# EAGLE design bm1397 (EAGLE 9.6.2)

## Sheet 1 of 3
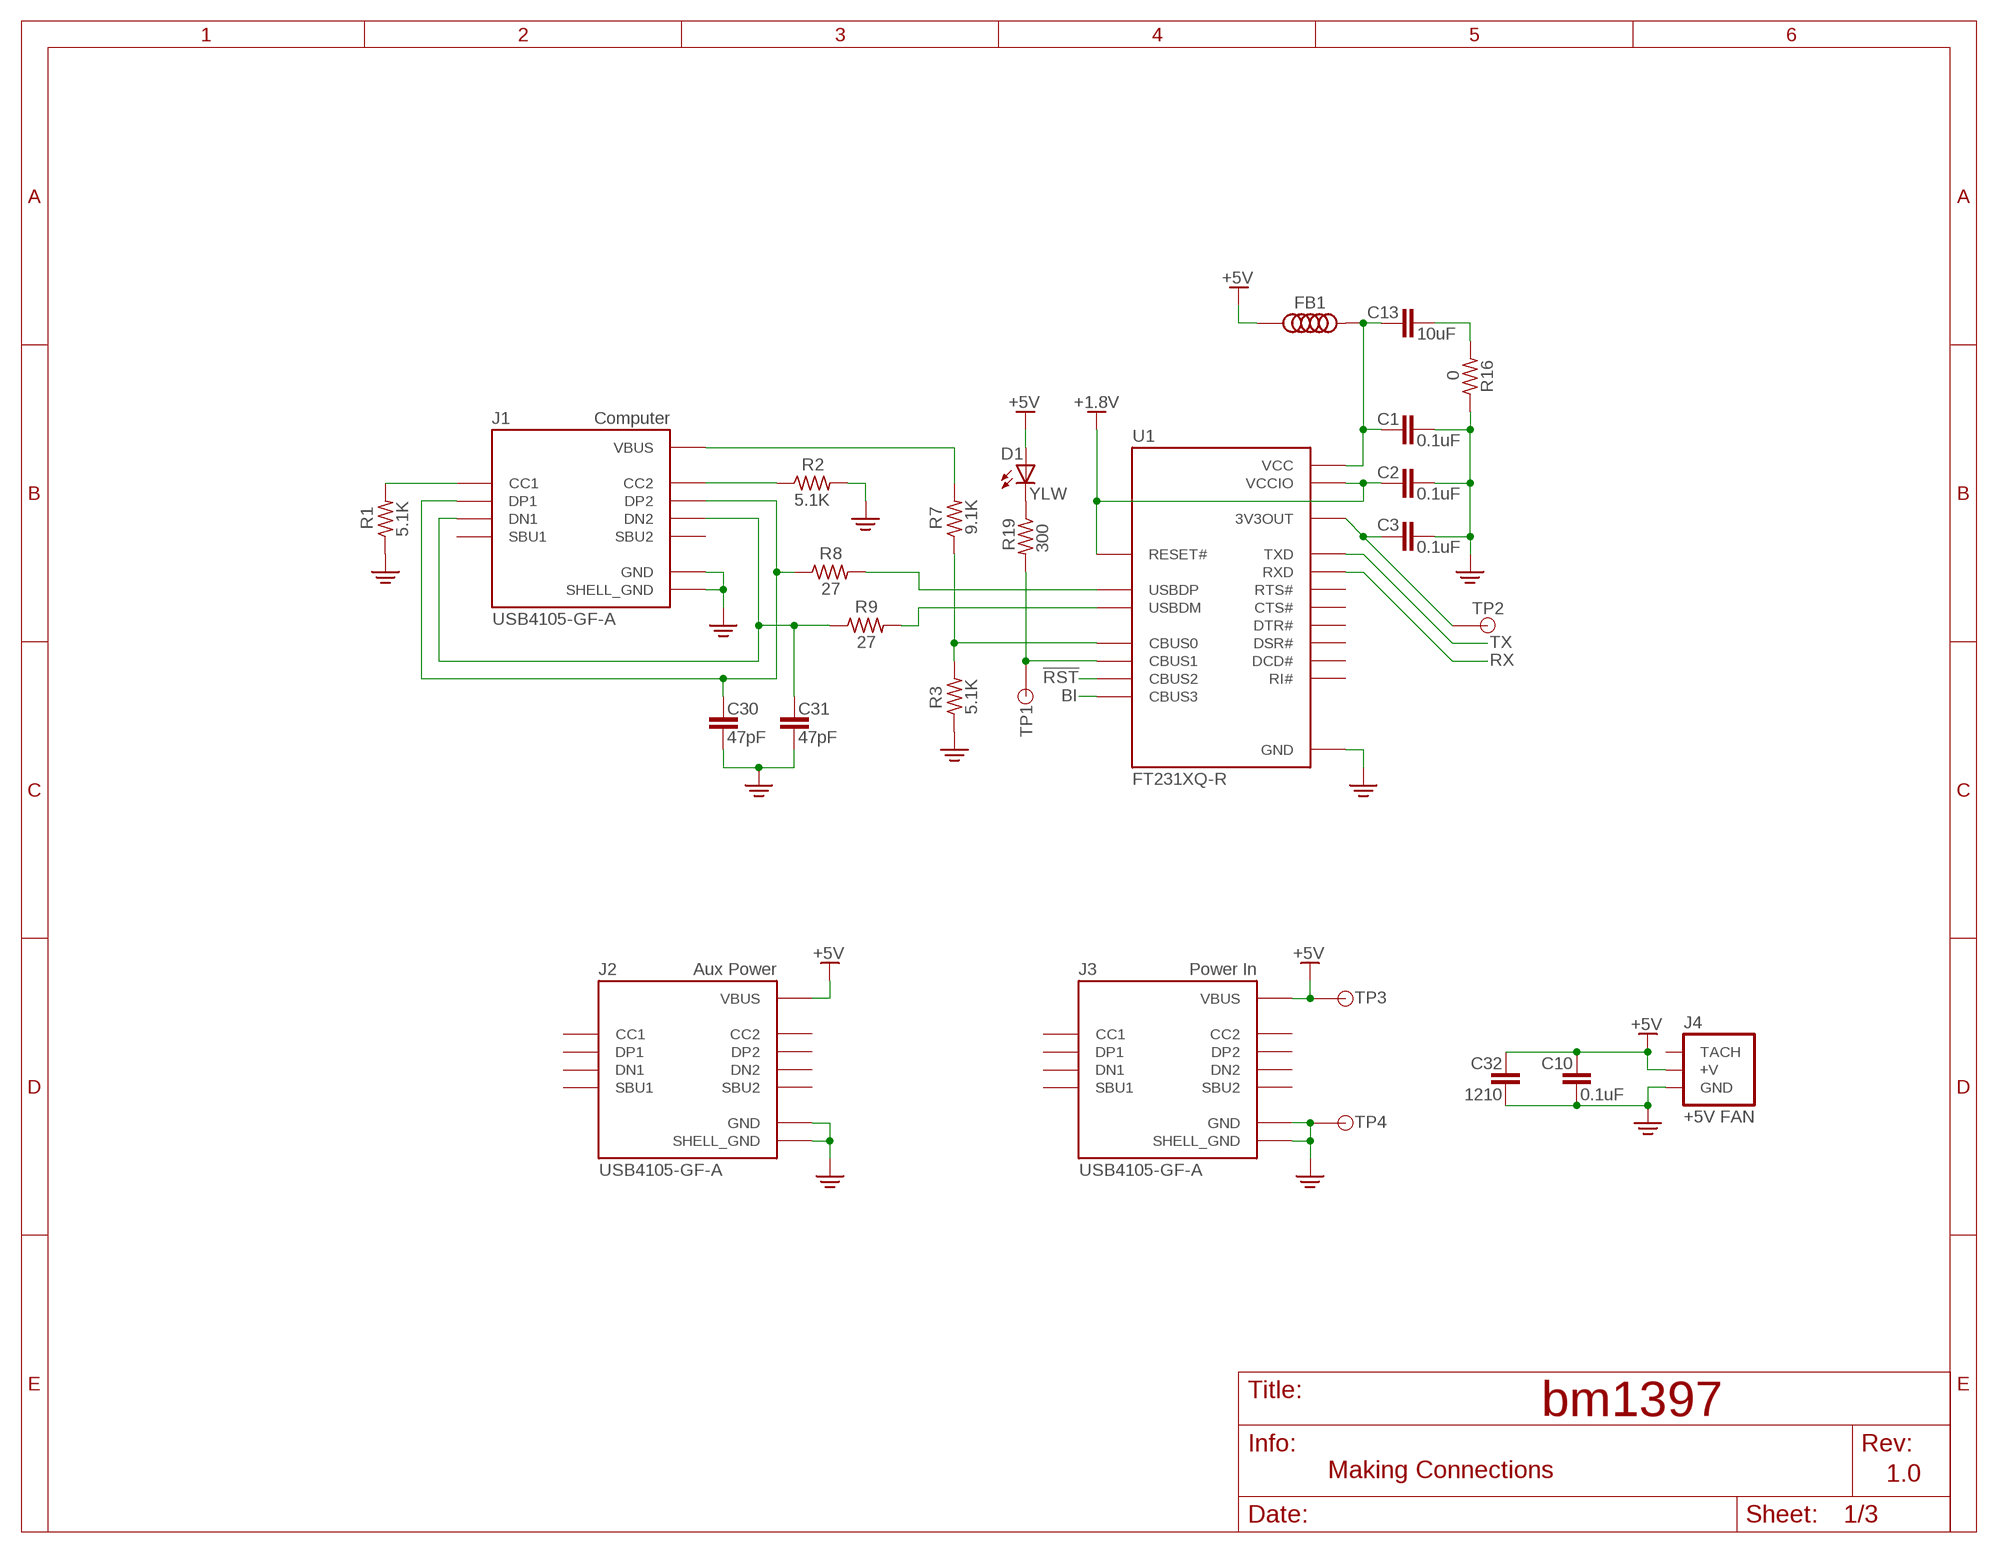
[diagram p0: schematic, sheet 1]

### Parts
C1  0.1uF  NPOL_CAPACITORC0402  [C0402]
C2  0.1uF  NPOL_CAPACITORC0402  [C0402]
C3  0.1uF  NPOL_CAPACITORC0402  [C0402]
C10  0.1uF  NPOL_CAPACITORC0402  [C0402]
C13  10uF  NPOL_CAPACITORC0805  [C0805]
C30  47pF  NPOL_CAPACITORC0402  [C0402]
C31  47pF  NPOL_CAPACITORC0402  [C0402]
C32  1210  NPOL_CAPACITORC1210  [C1210]
D1  YLW  LED  [0805_SD_MNT]
FB1  FERRITE_BEADF0402  [F0402]
J1  USB4105-GF-A  [GCT_USB4105-GF-A]
J2  USB4105-GF-A  [GCT_USB4105-GF-A]
J3  USB4105-GF-A  [GCT_USB4105-GF-A]
J4  +5V FAN  3PIN_FAN3PIN_FAN  [3PIN_LOCK_HEADER]
R1  5.1K  RESISTORR0402  [R0402]
R2  5.1K  RESISTORR0402  [R0402]
R3  5.1K  RESISTORR0402  [R0402]
R7  9.1K  RESISTORR0402  [R0402]
R8  27  RESISTORR0402  [R0402]
R9  27  RESISTORR0402  [R0402]
R16  0  RESISTORR0402  [R0402]
R19  300  RESISTORR0402  [R0402]
TP1  TESTPOINT  [0.035]
TP2  TESTPOINT  [0.035]
TP3  TESTPOINT  [0.035]
TP4  TESTPOINT  [0.035]
U1  FT231XQ-R  [QFN50P400X400X80-21N]

### Nets
!RST: U1.7(CBUS2) ; also sheet 3
+1V8: C2.1 U1.11(RESET#) U1.20(VCCIO) ; supply symbol labelled +1.8V ; also sheet 2,3
+5V: C10.2 C32.1 D1.A FB1.1 J2.A4_B9(VBUS) J2.B4_A9(VBUS) J3.A4_B9(VBUS) J3.B4_A9(VBUS) J4.2(+V) TP3.TP ; also sheet 2
BI: U1.16(CBUS3) ; also sheet 3
CC1: J1.A5(CC1) R1.2
CC2: J1.B5(CC2) R2.1
FB+5V: C1.1 C13.1 FB1.2 U1.12(VCC)
GND: C1.2 C2.2 C3.2 C10.1 C30.1 C31.1 C32.2 J1.A1_B12(GND) J1.B1_A12(GND) J1.S1(SHELL_GND) J1.S2(SHELL_GND) J1.S3(SHELL_GND) J1.S4(SHELL_GND) J2.A1_B12(GND) J2.B1_A12(GND) J2.S1(SHELL_GND) J2.S2(SHELL_GND) J2.S3(SHELL_GND) J2.S4(SHELL_GND) J3.A1_B12(GND) J3.B1_A12(GND) J3.S1(SHELL_GND) J3.S2(SHELL_GND) J3.S3(SHELL_GND) J3.S4(SHELL_GND) J4.1(GND) R1.1 R2.2 R3.1 R16.1 TP4.TP U1.3(GND) U1.13(GND) U1.21(GND) ; also sheet 2,3
N$1: C13.2 R16.2
N$2: R8.2 U1.8(USBDP)
N$3: C30.2 J1.A6(DP1) J1.B6(DP2) R8.1
N$4: C31.2 J1.A7(DN1) J1.B7(DN2) R9.1
N$5: D1.C R19.1
N$6: R9.2 U1.9(USBDM)
N$8: R3.2 R7.1 U1.15(CBUS0)
N$9: J1.A4_B9(VBUS) J1.B4_A9(VBUS) R7.2
N$11: C3.1 TP2.TP U1.10(3V3OUT)
N$12: R19.2 TP1.TP U1.14(CBUS1)
RX: U1.1(RXD) ; also sheet 3
TX: U1.17(TXD) ; also sheet 3
Unconnected: J1.A8(SBU1) J1.B8(SBU2) J2.A5(CC1) J2.A6(DP1) J2.A7(DN1) J2.A8(SBU1) J2.B5(CC2) J2.B6(DP2) J2.B7(DN2) J2.B8(SBU2) J3.A5(CC1) J3.A6(DP1) J3.A7(DN1) J3.A8(SBU1) J3.B5(CC2) J3.B6(DP2) J3.B7(DN2) J3.B8(SBU2) J4.3(TACH) U1.2(RI#) U1.4(DSR#) U1.5(DCD#) U1.6(CTS#) U1.18(DTR#) U1.19(RTS#)

### Notes on the sheet
- Computer
- Aux Power | Power In
- Making Connections | 1.0

## Sheet 2 of 3
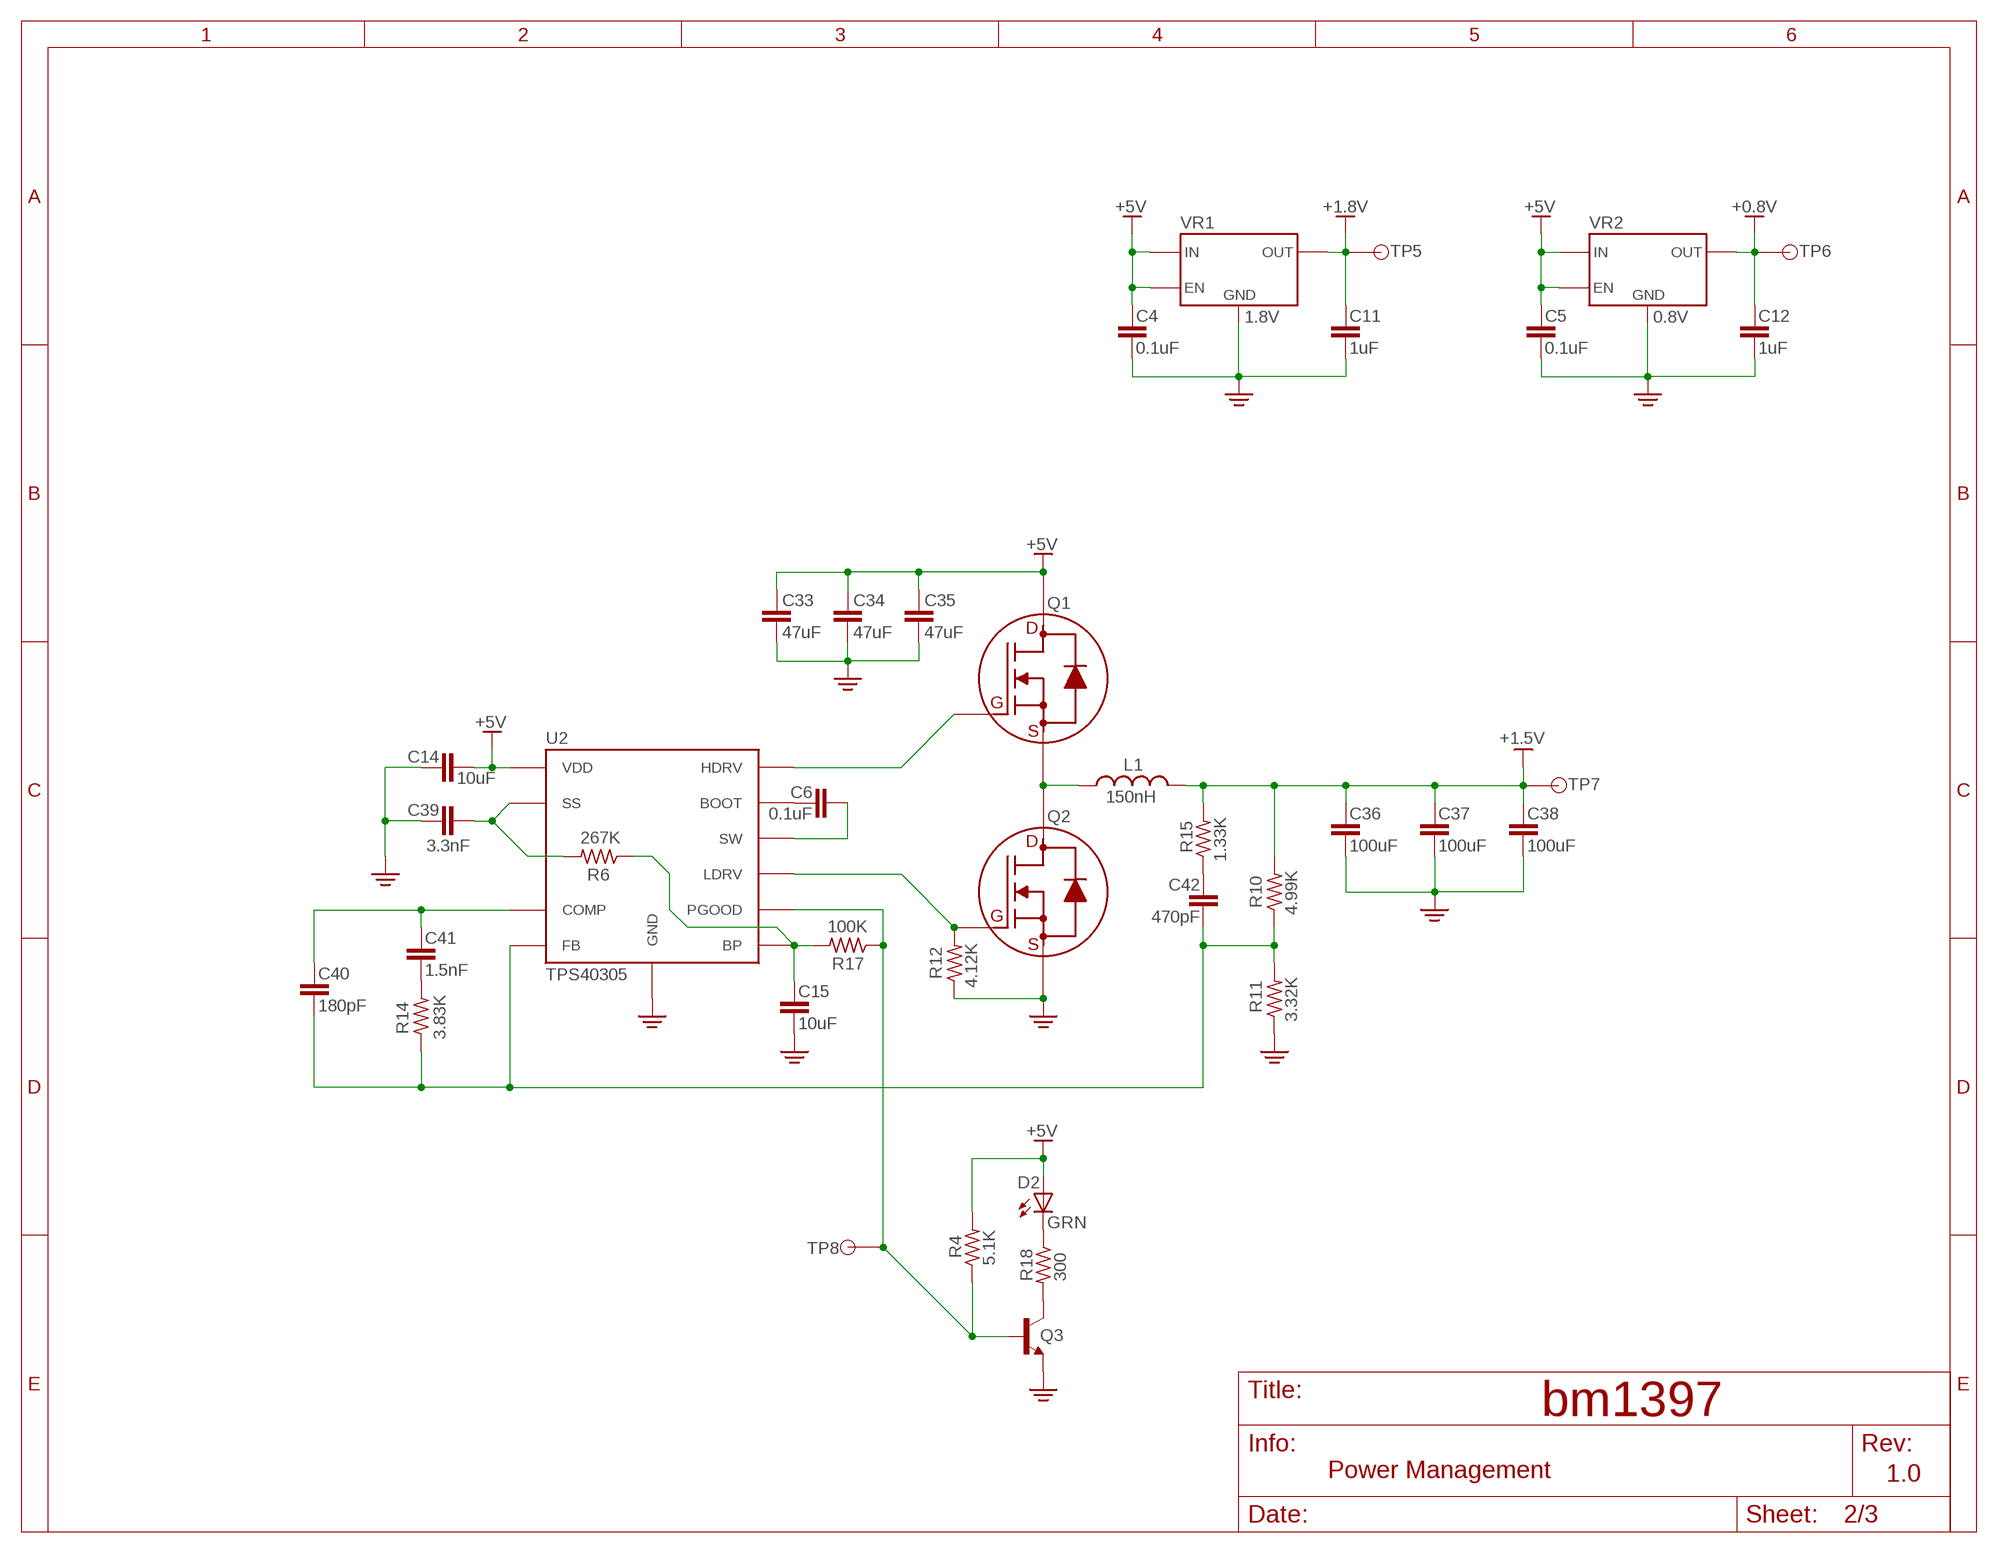
[diagram p1: schematic, sheet 2]

### Parts
C4  0.1uF  NPOL_CAPACITORC0402  [C0402]
C5  0.1uF  NPOL_CAPACITORC0402  [C0402]
C6  0.1uF  NPOL_CAPACITORC0402  [C0402]
C11  1uF  NPOL_CAPACITORC0603  [C0603]
C12  1uF  NPOL_CAPACITORC0603  [C0603]
C14  10uF  NPOL_CAPACITORC0805  [C0805]
C15  10uF  NPOL_CAPACITORC0805  [C0805]
C33  47uF  NPOL_CAPACITORC1210  [C1210]
C34  47uF  NPOL_CAPACITORC1210  [C1210]
C35  47uF  NPOL_CAPACITORC1210  [C1210]
C36  100uF  NPOL_CAPACITORC1210  [C1210]
C37  100uF  NPOL_CAPACITORC1210  [C1210]
C38  100uF  NPOL_CAPACITORC1210  [C1210]
C39  3.3nF  NPOL_CAPACITORC0402  [C0402]
C40  180pF  NPOL_CAPACITORC0402  [C0402]
C41  1.5nF  NPOL_CAPACITORC0402  [C0402]
C42  470pF  NPOL_CAPACITORC0402  [C0402]
D2  GRN  LED  [0805_SD_MNT]
L1  150nH  SMD_INDUCTOR10.2MMX7.0MM  [10.2MMX7.0MM]
Q1  8-PowerTDFN  CSD17311Q5  [CSD17311Q5]
Q2  8-PowerTDFN  CSD17311Q5  [CSD17311Q5]
Q3  NPN  [SOT23]
R4  5.1K  RESISTORR0402  [R0402]
R6  267K  RESISTORR0402  [R0402]
R10  4.99K  RESISTORR0402  [R0402]
R11  3.32K  RESISTORR0402  [R0402]
R12  4.12K  RESISTORR0402  [R0402]
R14  3.83K  RESISTORR0402  [R0402]
R15  1.33K  RESISTORR0402  [R0402]
R17  100K  RESISTORR0402  [R0402]
R18  300  RESISTORR0402  [R0402]
TP5  TESTPOINT  [0.035]
TP6  TESTPOINT  [0.035]
TP7  TESTPOINT  [0.035]
TP8  TESTPOINT  [0.035]
U2  TPS40305  [TPS40305]
VR1  1.8V  REGULATOR-ENTSOP-5  [TSOP-5]
VR2  0.8V  REGULATOR-ENTSOP-5  [TSOP-5]

### Nets
+0V8: C12.1 TP6.TP VR2.5(OUT) ; supply symbol labelled +0.8V ; also sheet 3
+1V5: C36.1 C37.1 C38.1 L1.2 R10.2 R15.2 TP7.TP ; supply symbol labelled +1.5V ; also sheet 3
+1V8: C11.1 TP5.TP VR1.5(OUT) ; supply symbol labelled +1.8V ; also sheet 1,3
+5V: C4.1 C5.1 C14.1 C33.1 C34.1 C35.1 D2.A Q1.5(D) Q1.6(D) Q1.7(D) Q1.8(D) Q1.9(D) R4.2 U2.1(VDD) VR1.1(IN) VR1.3(EN) VR2.1(IN) VR2.3(EN) ; also sheet 1
BP: C15.1 R6.1 R17.2 U2.10(BP)
GND: C4.2 C5.2 C11.2 C12.2 C14.2 C15.2 C33.2 C34.2 C35.2 C36.2 C37.2 C38.2 C39.2 Q2.1(S) Q2.2(S) Q2.3(S) Q3.2(E) R11.1 R12.1 U2.11(GND) U2.12(GND) U2.13(GND) U2.14(GND) U2.15(GND) VR1.2(GND) VR2.2(GND) ; also sheet 1,3
HDRV: Q1.4(G) U2.7(HDRV)
LDRV: Q2.4(G) R12.2 U2.9(LDRV)
LIN: L1.1 Q1.1(S) Q1.2(S) Q1.3(S) Q2.5(D) Q2.6(D) Q2.7(D) Q2.8(D) Q2.9(D)
N$10: C40.1 C41.1 U2.4(COMP)
N$13: C41.2 R14.2
N$16: C6.2 U2.6(BOOT)
N$37: C6.1 U2.8(SW)
N$55: C42.1 R15.1
N$56: C40.2 C42.2 R10.1 R11.2 R14.1 U2.5(FB)
N$58: D2.C R18.1
N$60: Q3.3(C) R18.2
PGOOD: Q3.1(B) R4.1 R17.1 TP8.TP U2.3(PGOOD)
SS: C39.1 R6.2 U2.2(SS)

### Notes on the sheet
- Power Management | 1.0

## Sheet 3 of 3
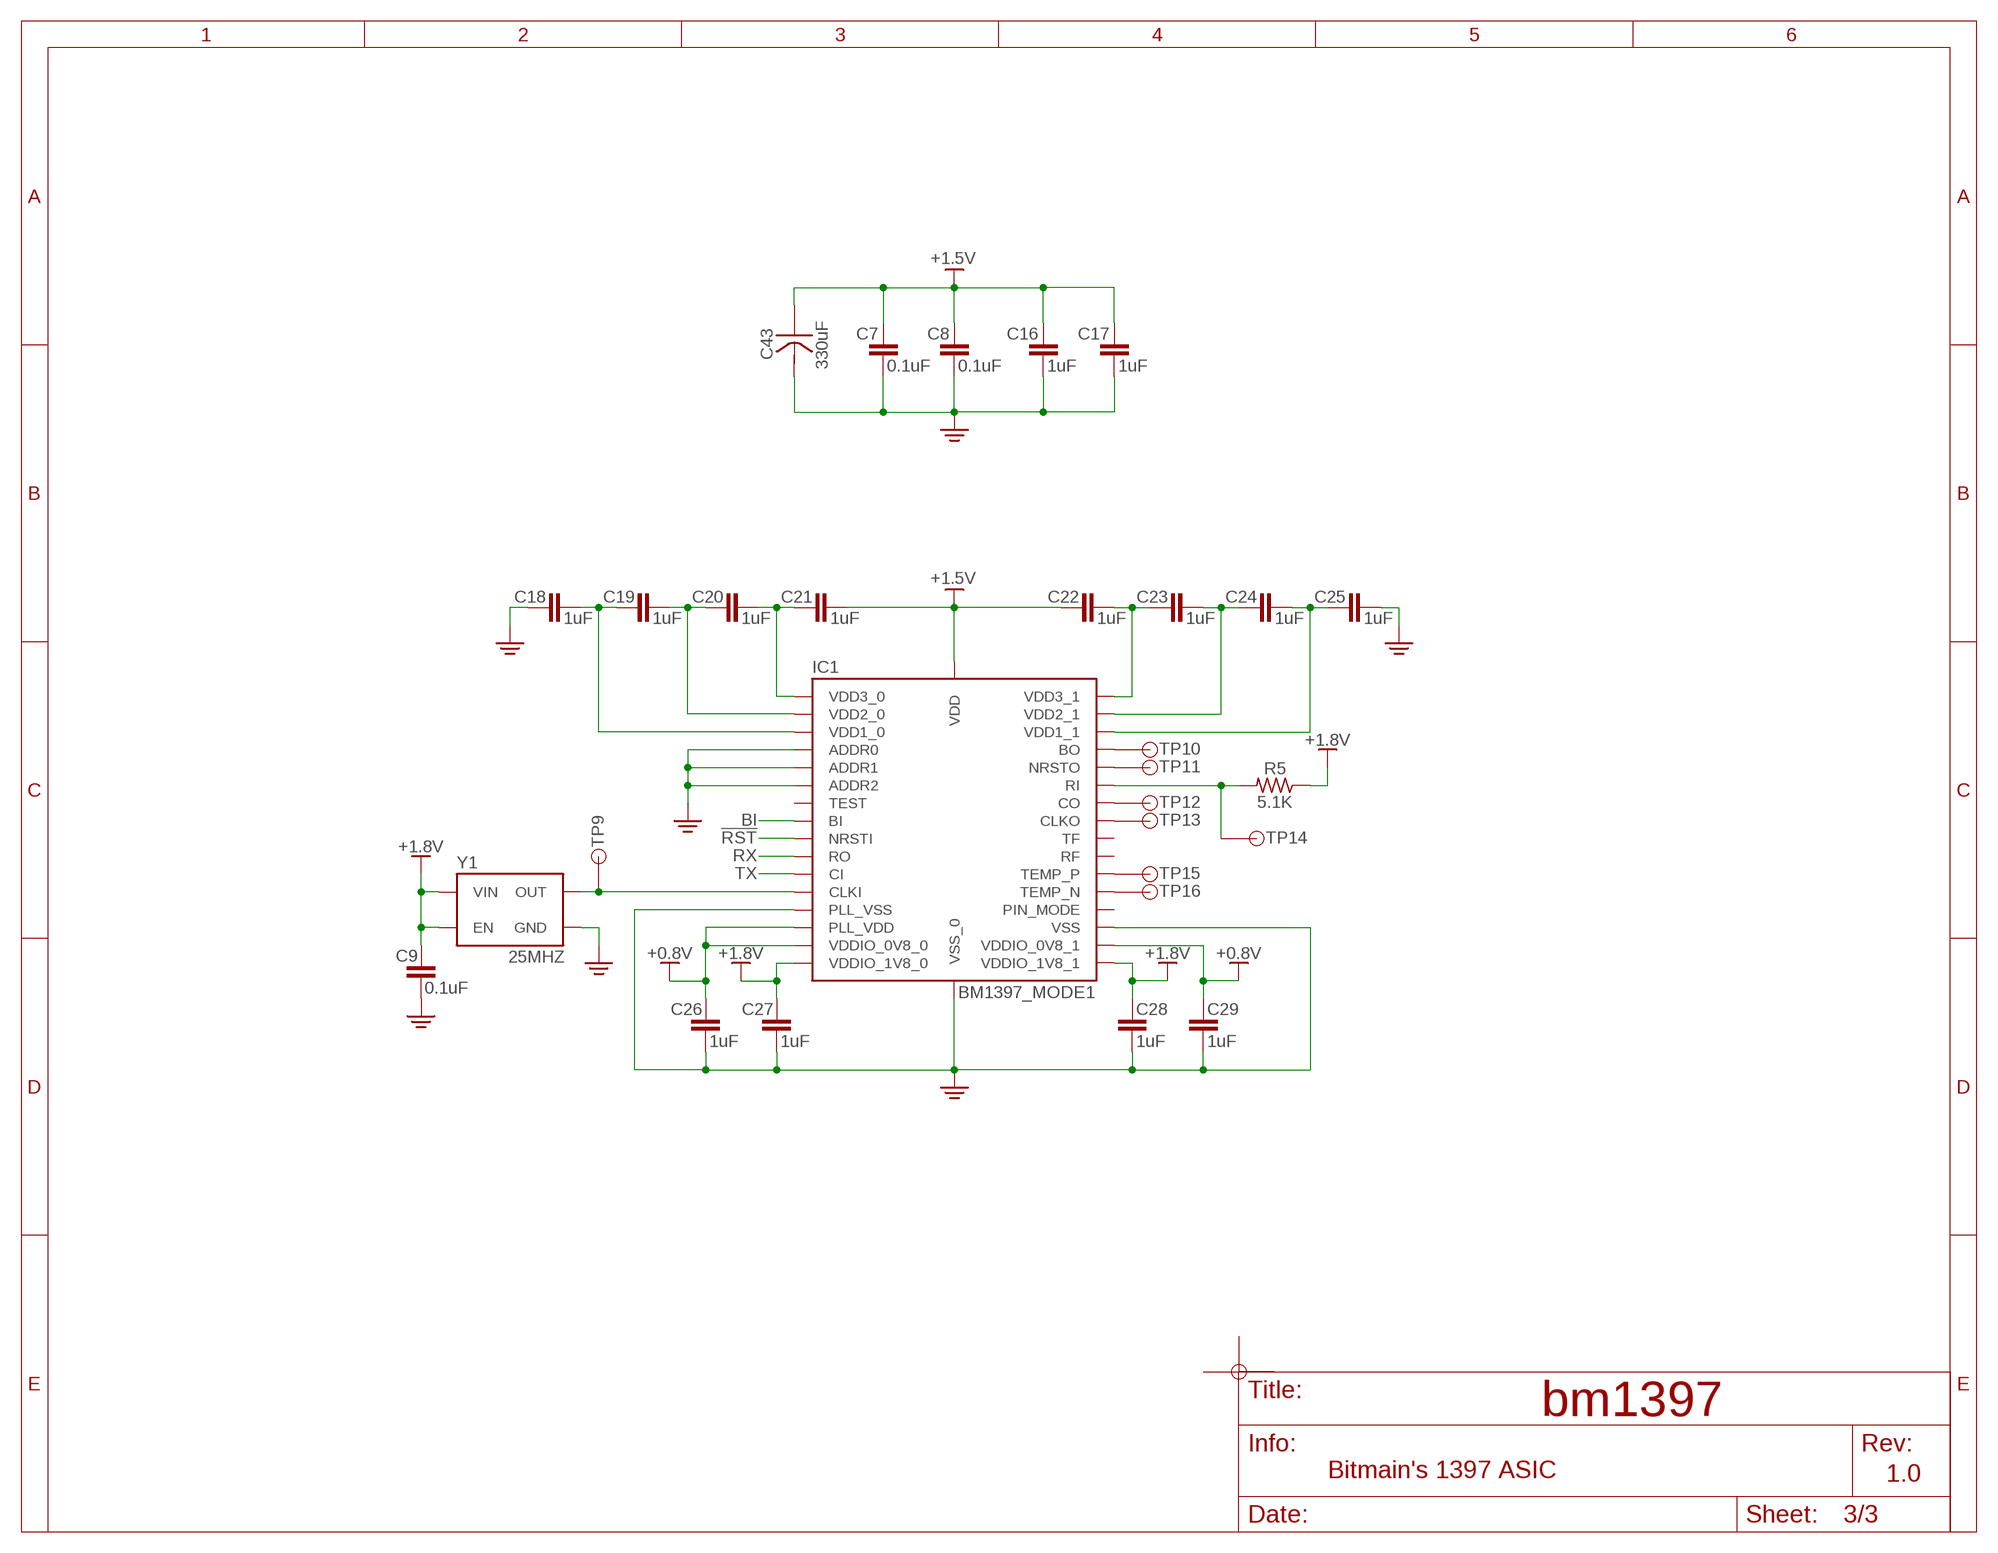
[diagram p2: schematic, sheet 3]

### Parts
BOTFIDUCIAL1  TESTPOINT  [0.035]
BOTFIDUCIAL2  TESTPOINT  [0.035]
BOTFIDUCIAL3  TESTPOINT  [0.035]
C7  0.1uF  NPOL_CAPACITORC0402  [C0402]
C8  0.1uF  NPOL_CAPACITORC0402  [C0402]
C9  0.1uF  NPOL_CAPACITORC0402  [C0402]
C16  1uF  NPOL_CAPACITORC0603  [C0603]
C17  1uF  NPOL_CAPACITORC0603  [C0603]
C18  1uF  NPOL_CAPACITORC0603  [C0603]
C19  1uF  NPOL_CAPACITORC0603  [C0603]
C20  1uF  NPOL_CAPACITORC0603  [C0603]
C21  1uF  NPOL_CAPACITORC0603  [C0603]
C22  1uF  NPOL_CAPACITORC0603  [C0603]
C23  1uF  NPOL_CAPACITORC0603  [C0603]
C24  1uF  NPOL_CAPACITORC0603  [C0603]
C25  1uF  NPOL_CAPACITORC0603  [C0603]
C26  1uF  NPOL_CAPACITORC0603  [C0603]
C27  1uF  NPOL_CAPACITORC0603  [C0603]
C28  1uF  NPOL_CAPACITORC0603  [C0603]
C29  1uF  NPOL_CAPACITORC0603  [C0603]
C43  330uF  POL_CAPACITORTANT_3.5MMX2.8MM  [TANT_3.5MMX2.8MM]
IC1  BM1397_MODE1  [BM1397]
R5  5.1K  RESISTORR0402  [R0402]
TOPFIDUCIAL1  TESTPOINT  [0.035]
TOPFIDUCIAL2  TESTPOINT  [0.035]
TOPFIDUCIAL3  TESTPOINT  [0.035]
TP9  TESTPOINT  [0.035]
TP10  TESTPOINT  [0.035]
TP11  TESTPOINT  [0.035]
TP12  TESTPOINT  [0.035]
TP13  TESTPOINT  [0.035]
TP14  TESTPOINT  [0.035]
TP15  TESTPOINT  [0.035]
TP16  TESTPOINT  [0.035]
Y1  25MHZ  JO32_OSCILLATOR  [JO32_3.20MMX2.50MM]

### Nets
!RST: IC1.9(NRSTI) ; also sheet 1
+0V8: C26.1 C29.1 IC1.14(PLL_VDD) IC1.15(VDDIO_0V8_0) IC1.18(VDDIO_0V8_1) ; supply symbol labelled +0.8V ; also sheet 2
+1V5: C7.2 C8.2 C16.2 C17.2 C21.2 C22.2 C43.A(+) IC1.33(VDD) ; supply symbol labelled +1.5V ; also sheet 2
+1V8: C9.2 C27.1 C28.1 IC1.16(VDDIO_1V8_0) IC1.17(VDDIO_1V8_1) R5.1 Y1.1(EN) Y1.4(VIN) ; supply symbol labelled +1.8V ; also sheet 1,2
BI: IC1.8(BI) ; also sheet 1
CLK: IC1.12(CLKI) TP9.TP Y1.3(OUT)
GND: C7.1 C8.1 C9.1 C16.1 C17.1 C18.1 C25.1 C26.2 C27.2 C28.2 C29.2 C43.C(-) IC1.4(ADDR0) IC1.5(ADDR1) IC1.6(ADDR2) IC1.13(PLL_VSS) IC1.19(VSS) IC1.34(VSS_0) Y1.2(GND) ; also sheet 1,2
N$7: BOTFIDUCIAL2.TP TOPFIDUCIAL1.TP
N$14: C19.2 C20.1 IC1.2(VDD2_0)
N$15: BOTFIDUCIAL3.TP TOPFIDUCIAL3.TP
N$17: C18.2 C19.1 IC1.3(VDD1_0)
N$18: C20.2 C21.1 IC1.1(VDD3_0)
N$19: C22.1 C23.2 IC1.32(VDD3_1)
N$20: C23.1 C24.2 IC1.31(VDD2_1)
N$21: C24.1 C25.2 IC1.30(VDD1_1)
N$25: IC1.21(TEMP_N) TP16.TP
N$26: IC1.22(TEMP_P) TP15.TP
N$27: IC1.25(CLKO) TP13.TP
N$28: IC1.26(CO) TP12.TP
N$30: IC1.27(RI) R5.2 TP14.TP
N$32: IC1.28(NRSTO) TP11.TP
N$33: IC1.29(BO) TP10.TP
RX: IC1.10(RO) ; also sheet 1
TX: IC1.11(CI) ; also sheet 1
Unconnected: BOTFIDUCIAL1.TP IC1.7(TEST) IC1.20(PIN_MODE) IC1.23(RF) IC1.24(TF) TOPFIDUCIAL2.TP

### Notes on the sheet
- Bitmain's 1397 ASIC | 1.0

## Library data of the parts
BOTFIDUCIAL1-BOTFIDUCIAL3 TOPFIDUCIAL1-TOPFIDUCIAL3 TP1-TP16 = testpoints:TESTPOINT
C1-C42 = capacitors:NPOL_CAPACITOR
C43 = capacitors:POL_CAPACITOR
D1 D2 = leds:LED
FB1 = ferrite_beads:FERRITE_BEAD
IC1 = BM1397:BM1397_MODE1
J1-J3 = USB4105-GF-A:USB4105-GF-A: USB-C (USB TYPE-C) USB 2.0 Receptacle Connector 24 (16+8 Dummy) Position Surface Mount, Right Angle; Through Hole Check availability <https://pricing.snapeda.com/parts/USB4105-GF-A/GCT/view-part?ref=eda>; AVAILABILITY: In Stock; DESCRIPTION: USB-C (USB TYPE-C) USB 2.0 Receptacle Connector 24 (16+8 Dummy) Position Surface Mount, Right Angle; Through Hole; MF: GCT; MP: USB4105-GF-A; PACKAGE: None; PRICE: None; PURCHASE-URL: https://pricing.snapeda.com/search?q=USB4105-GF-A&ref=eda
J4 = molex_fan:3PIN_FAN: 4 PIN MALE CPU FAN HEADER
L1 = inductors:SMD_INDUCTOR
Q1 Q2 = CSD17311Q5:CSD17311Q5: 30V, N ch NexFET MOSFET, single SON5x6, 2.3mOhm Source: Datasheet <http://www.ti.com/lit/gpn/csd17311q5>; DESCRIPTION: 30V, N ch NexFET MOSFET, single SON5x6, 2.3mOhm; HEIGHT: 1.05mm; MANUFACTURER_NAME: Texas Instruments; MANUFACTURER_PART_NUMBER: CSD17311Q5; MOUSER_PART_NUMBER: 595-CSD17311Q5; MOUSER_PRICE-STOCK: https://www.mouser.co.uk/ProductDetail/Texas-Instruments/CSD17311Q5?qs=5EfgEbZ17BBQ%252BOeglApYpg%3D%3D
Q3 = transistors:NPN: NPN Transistor
R1-R12 R14-R19 = resistors:RESISTOR: RESISTOR, American symbol
U1 = FT231XQ-R:FT231XQ-R: USB2.0 Full Speed IC offers a compact bridge to full handshake UART Interface Check availability <https://pricing.snapeda.com/parts/FT231XQ-R/FTDI%2C%20Future/view-part?ref=eda>; AVAILABILITY: In Stock; DESCRIPTION: USB Bridge, USB to UART USB 2.0 UART Interface 20-QFN (4x4); MF: FTDI, Future; MP: FT231XQ-R; PACKAGE: QFN-20 FTDI; PRICE: None; PURCHASE-URL: https://pricing.snapeda.com/search?q=FT231XQ-R&ref=eda
U2 = TPS40305:TPS40305: 3-20V Synchronous Buck Controller VSON10 Source: Datasheet <https://www.ti.com/lit/gpn/tps40305?HQS=ti-null-null-sf-df-pf-sep-wwe&DCM=yes?hkey=EF798316E3902B6ED9A73243A3159BB0>; DESCRIPTION: 3-20V Synchronous Buck Controller VSON10; HEIGHT: 1mm; MANUFACTURER_NAME: Texas Instruments; MANUFACTURER_PART_NUMBER: TPS40305DRCT; MOUSER_PART_NUMBER: 595-TPS40305DRCT; MOUSER_PRICE-STOCK: https://www.mouser.co.uk/ProductDetail/Texas-Instruments/TPS40305DRCT?qs=%2Fqzd9s%252BcLd6HGzrp6N31Wg%3D%3D
VR1 VR2 = regulators:REGULATOR-EN
Y1 = oscillators:JO32_OSCILLATOR

## Board
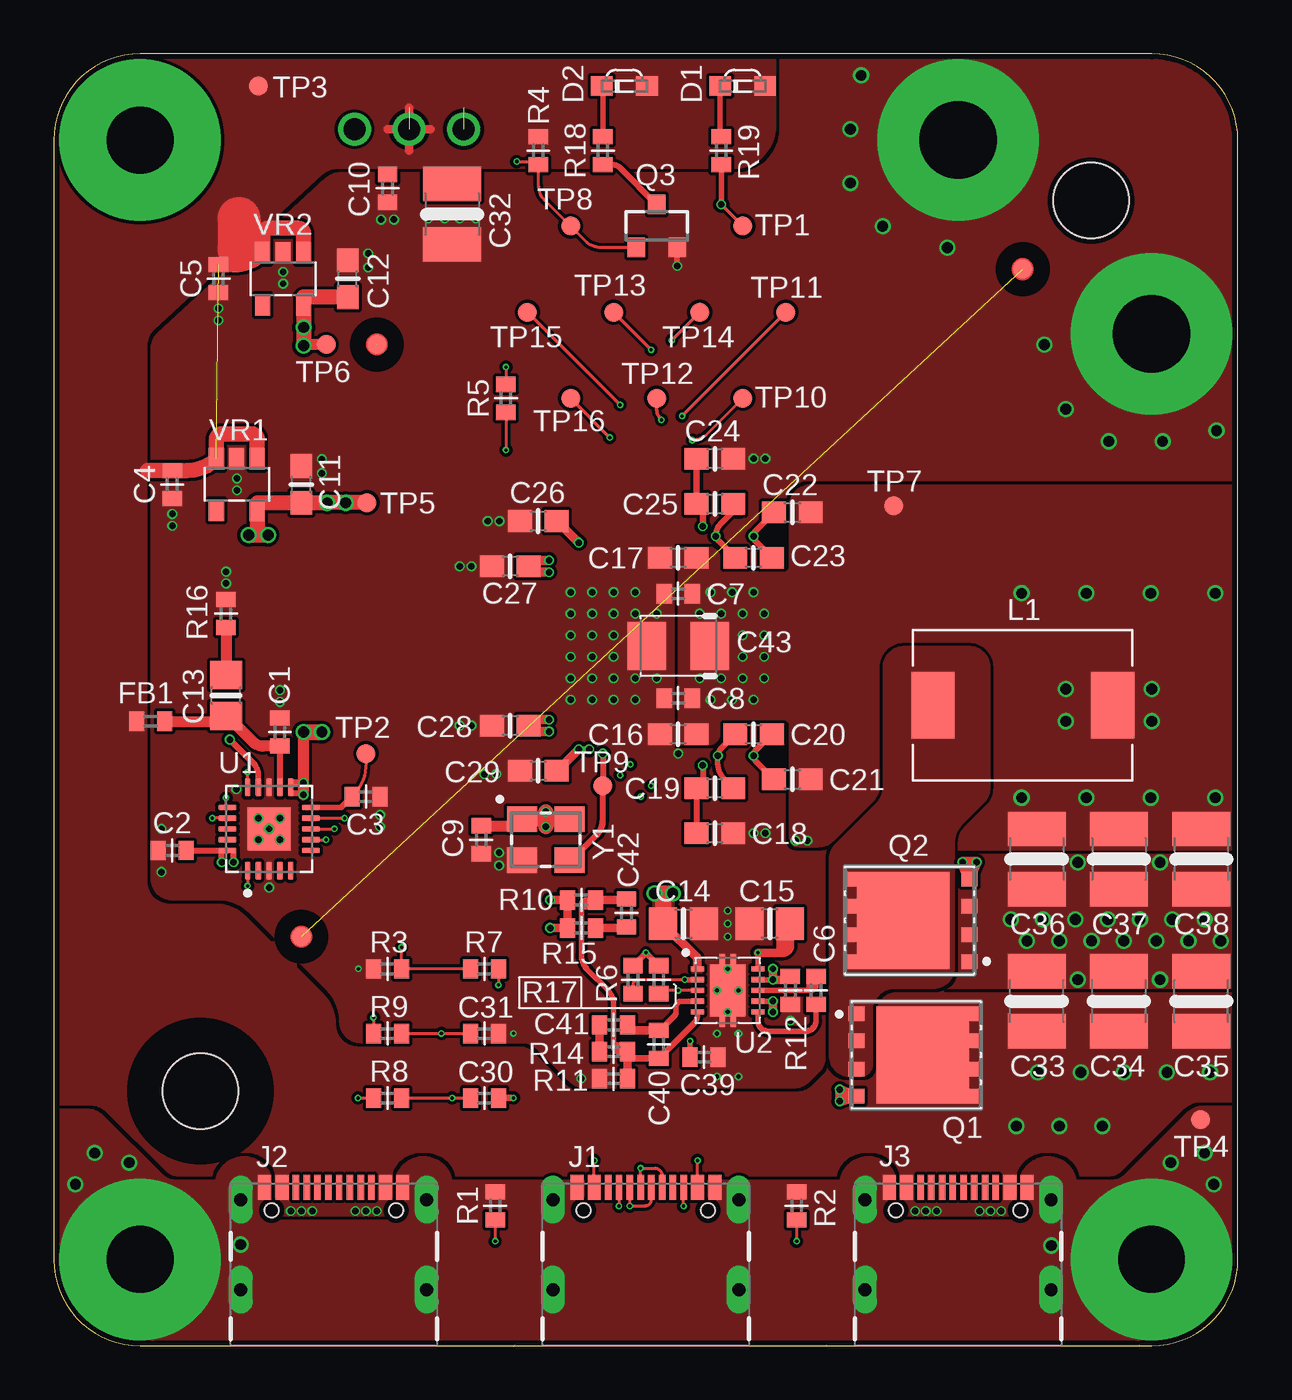
[diagram p3: board, top side]
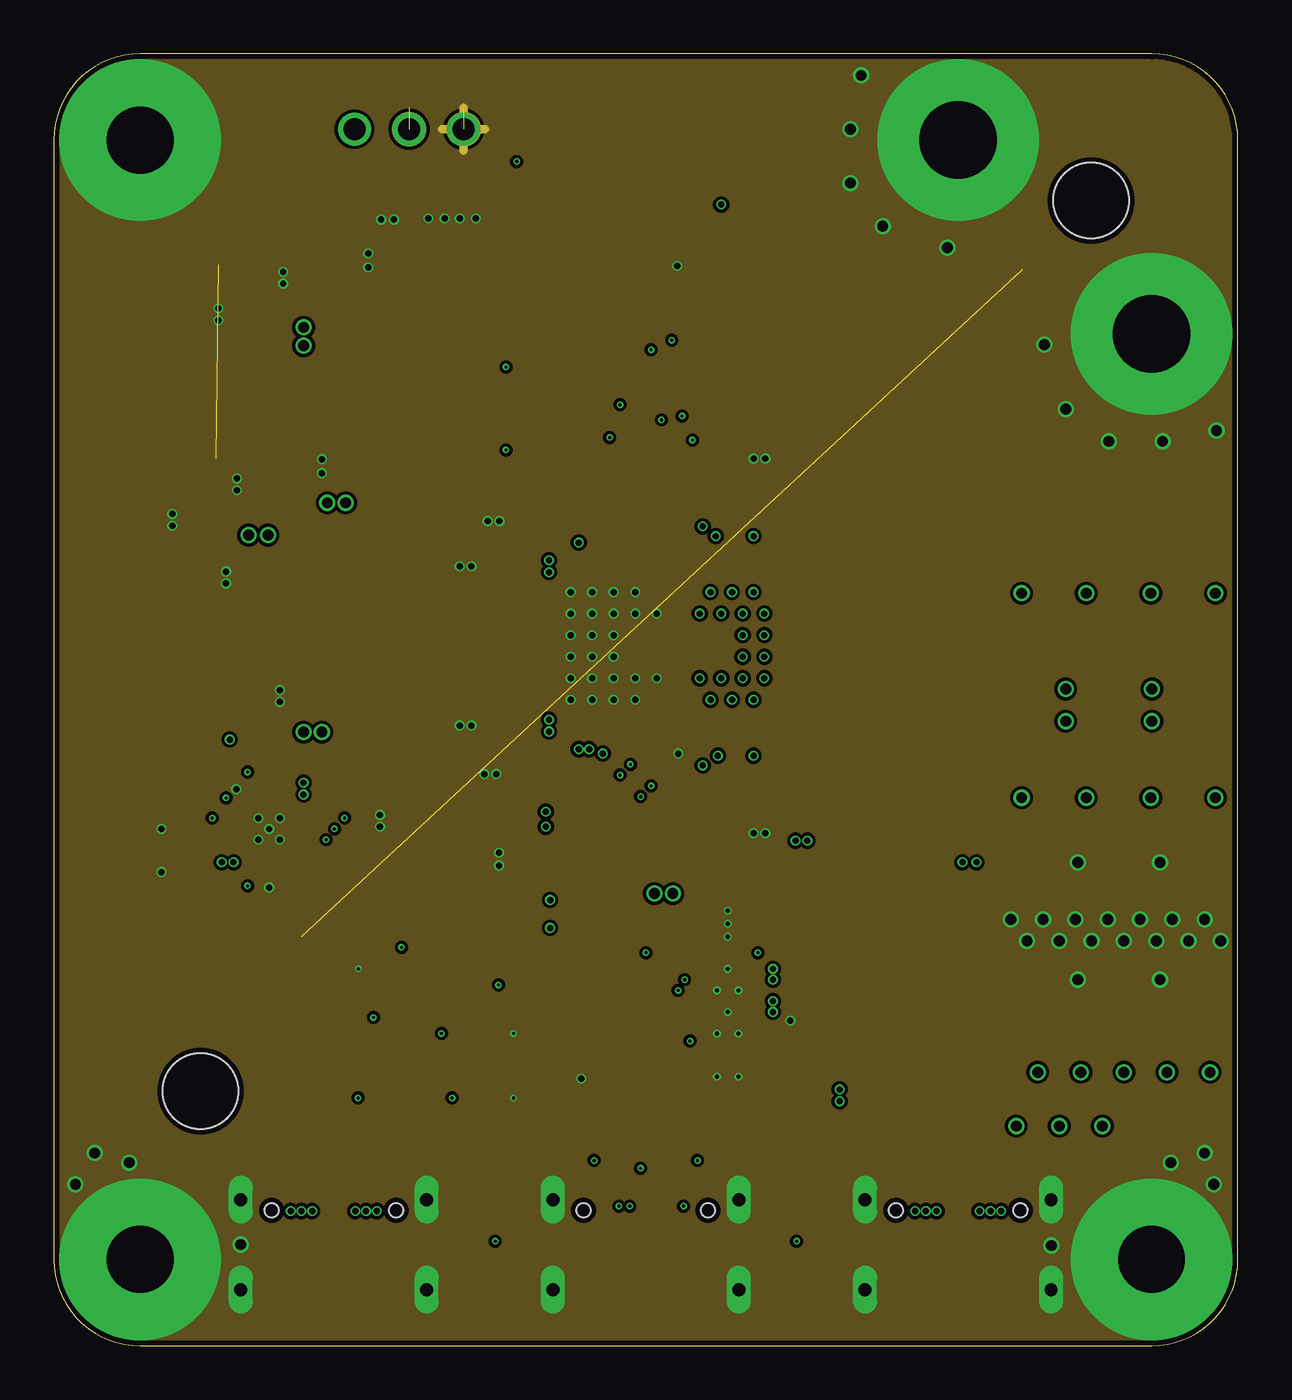
[diagram p4: board, inner layer tInner]
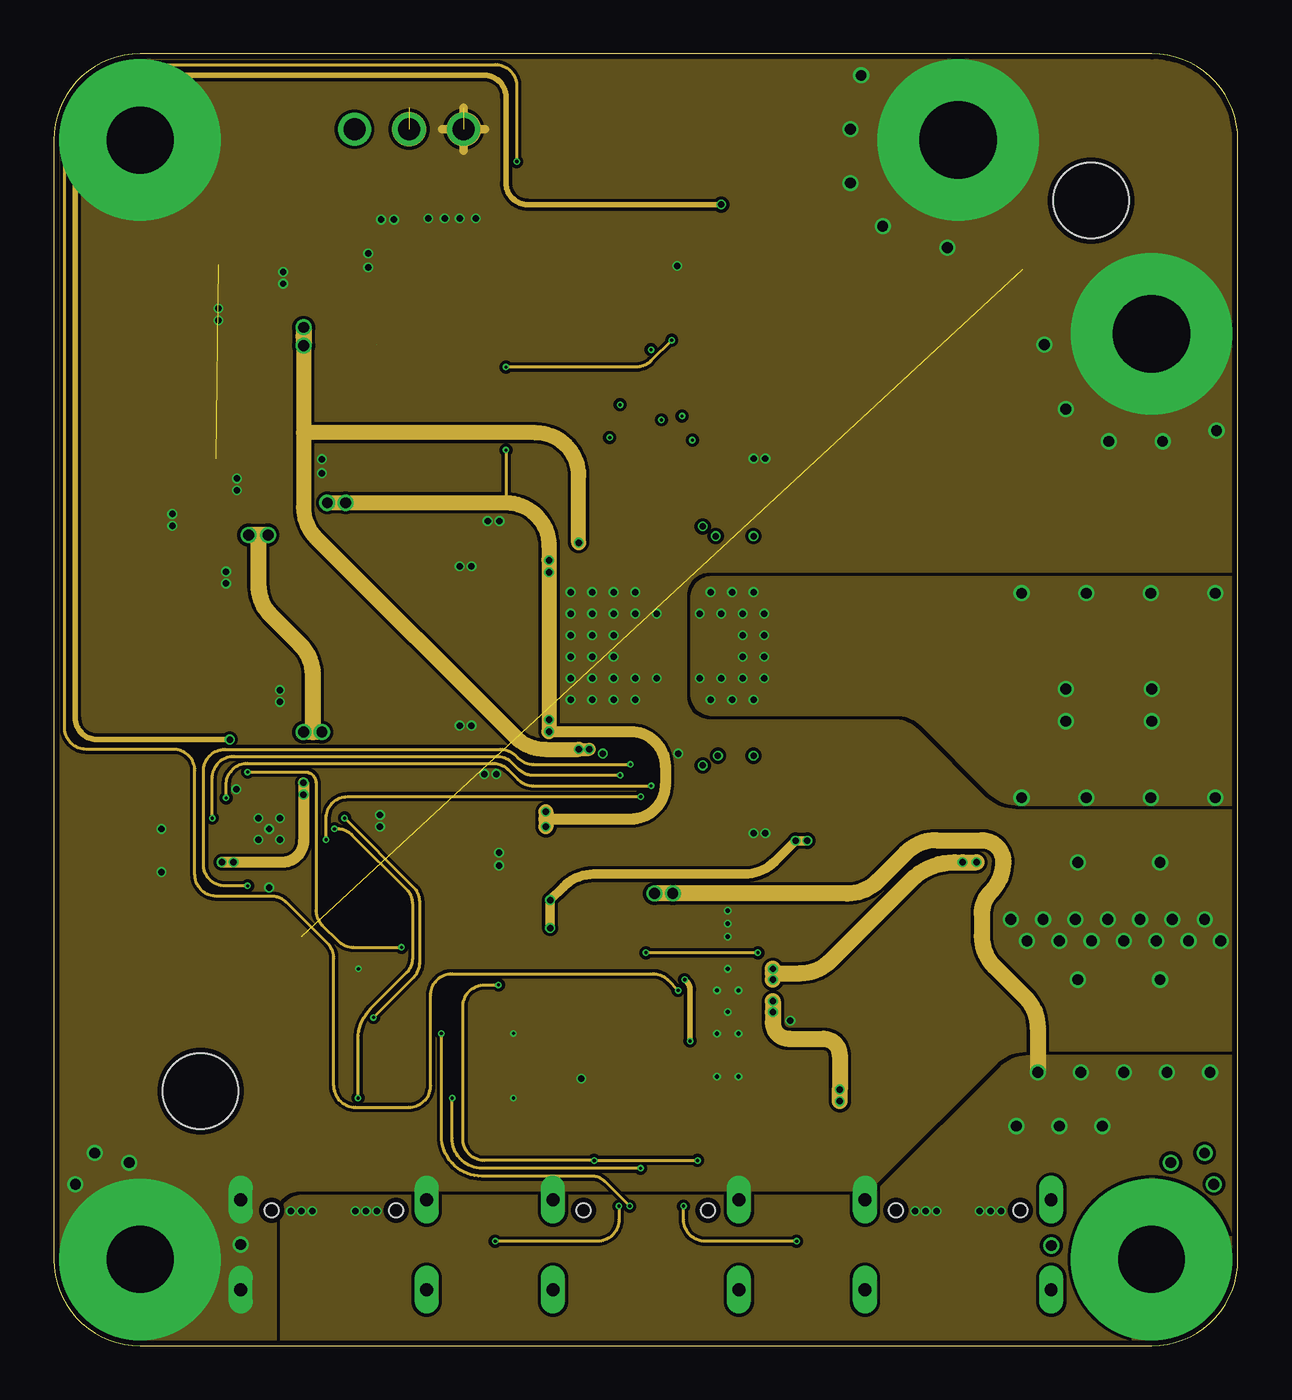
[diagram p5: board, inner layer bInner]
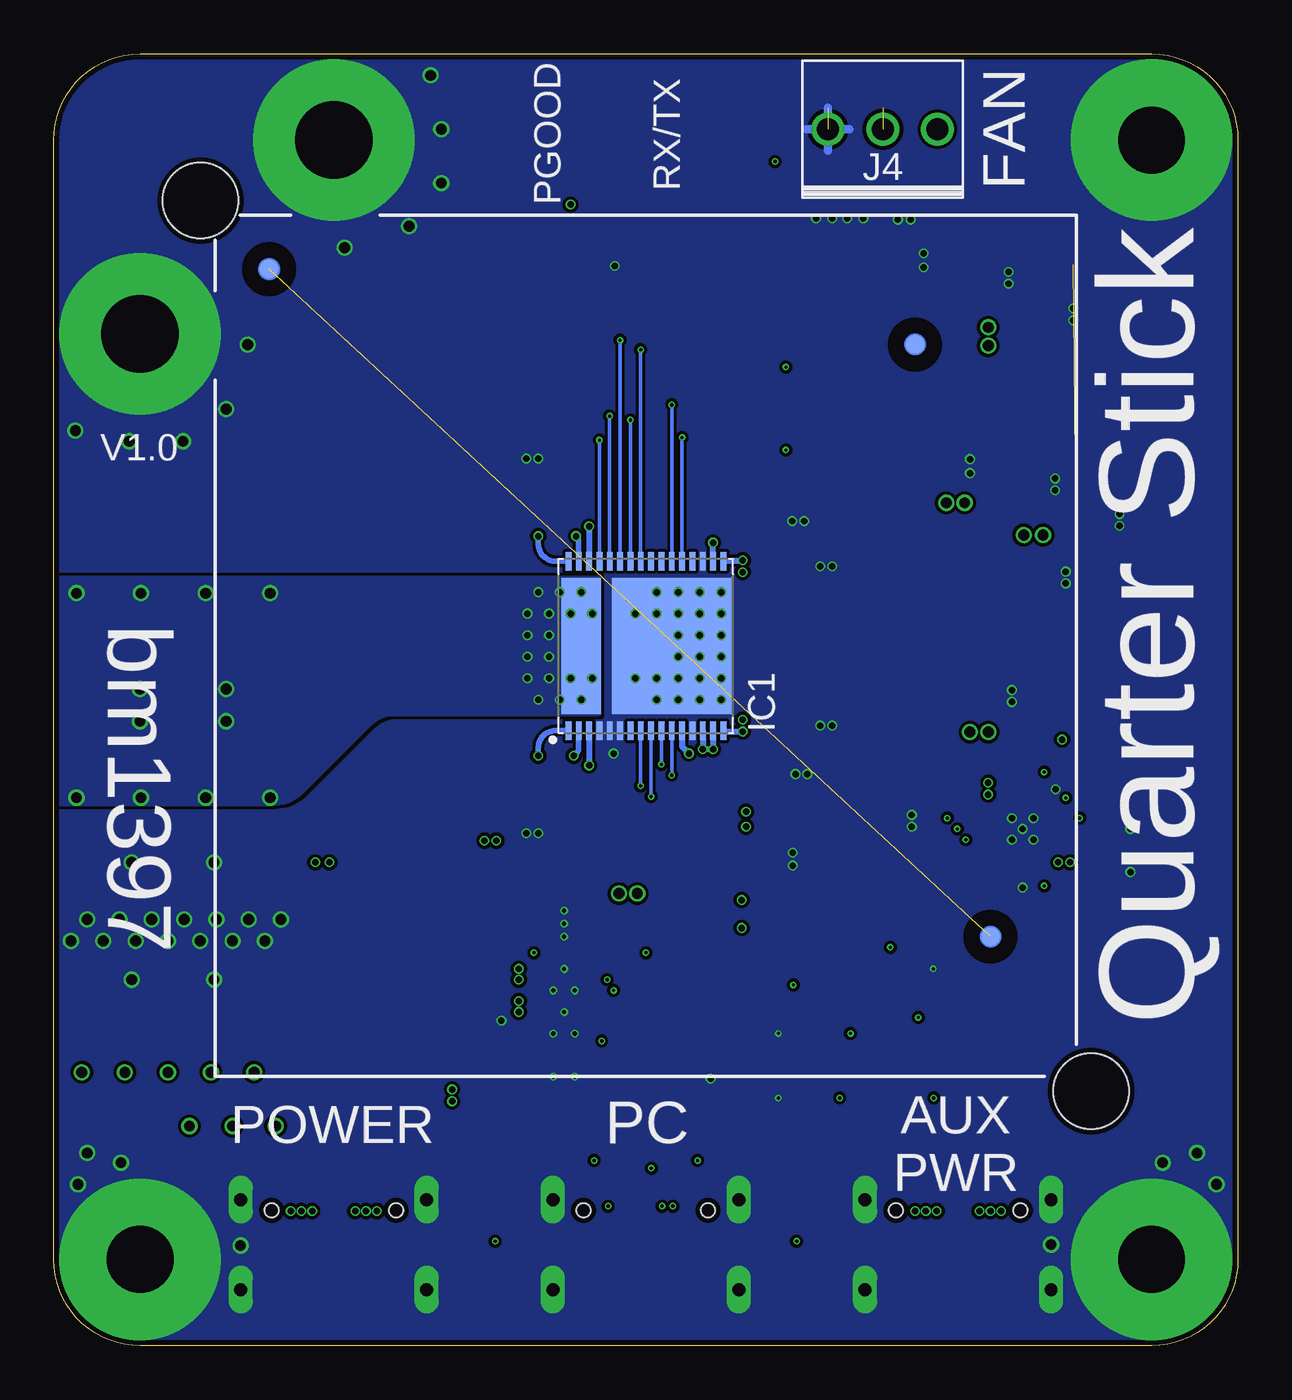
[diagram p6: board, bottom side, seen from below]

Size 55 x 60 mm. Coordinates in mm from the lower left corner, seen from the top.
Outline: 51,60 4,60 arc90 0,56 0,4 arc90 4,0 51,0 arc90 55,4 55,56 arc90 51,60
Copper layers (1*2*15*16): Top 0.035mm / dielectric 0.11mm / tInner 0.035mm / dielectric 0.8mm / bInner 0.035mm / dielectric 0.11mm / Bottom 0.035mm
Design rules "default *": minimum track width 3mil, minimum drill 0.15mm, track to track 3mil, track to pad 4mil, pad to pad 5mil, via to via 5mil, smd to smd 5mil, copper to edge 10mil, drill to drill 6mil, minimum pad ring 10mil, minimum via ring 3mil, stop-mask expansion 3mil, vias tented up to drill 0.5mm, thermal gap 10mil
Holes 3.5 mm at 6.82,11.82 48.18,53.18
tRestrict: area 3.6,8.6 to 10.1,15.1; area 43.9,48.9 to 46.1,51.1; area 10.4,17.9 to 12.6,20.1; area 13.9,45.4 to 16.1,47.6; area 43.9,48.9 to 46.1,51.1; area 15.7,55.7 to 17.3,57.3; area 18.2,55.7 to 19.8,57.3
bRestrict: area 10.4,17.9 to 12.6,20.1; area 43.9,48.9 to 46.1,51.1; area 13.9,45.4 to 16.1,47.6; area 15.7,55.7 to 17.3,57.3; area 18.2,55.7 to 19.8,57.3

### Footprints (pad centres in the part's own frame; a part is rotated, then mirrored left to right if it is on the bottom)
0.035 = smd 0.889 x 0.889: TP 0,0
C0402 = smd 0.7 x 0.9: 1 -0.65,0; 2 0.65,0
C0603 = smd 1.1 x 1: 1 -0.85,0; 2 0.85,0
C0805 = smd 1.3 x 1.5: 1 -0.95,0; 2 0.95,0
C1210 = smd 1.6 x 2.7: 1 -1.4,0; 2 1.4,0
TANT_3.5MMX2.8MM = smd 1.8 x 2.23: A -1.46,0; C 1.46,0
0805_SD_MNT = smd 0.9 x 1: A 0,1.05; C 0,-1.05
F0402 = smd 0.7 x 0.9: 1 -0.65,0; 2 0.65,0
BM1397 = smd 0.86 x 0.27: 1 -3.935,3.6; 2 -3.935,3.12; 3 -3.935,2.64; 4 -3.935,2.16; 5 -3.935,1.68; 6 -3.935,1.2; 7 -3.935,0.72; 8 -3.935,0.24; 9 -3.935,-0.24; 10 -3.935,-0.72; 11 -3.935,-1.2; 12 -3.935,-1.68; 13 -3.935,-2.16; 14 -3.935,-2.64; 15 -3.935,-3.12; 16 -3.935,-3.6; 17 3.935,-3.6; 18 3.935,-3.12; 19 3.935,-2.64; 20 3.935,-2.16; 21 3.935,-1.68; 22 3.935,-1.2; 23 3.935,-0.72; 24 3.935,-0.24; 25 3.935,0.24; 26 3.935,0.72; 27 3.935,1.2; 28 3.935,1.68; 29 3.935,2.16; 30 3.935,2.64; 31 3.935,3.12; 32 3.935,3.6 | smd 6.3 x 1.85: 33 0,3 | smd 6.3 x 5.55: 34 0,-1.2
GCT_USB4105-GF-A = smd 0.6 x 1.15: A1_B12 -3.2,4.755; A4_B9 -2.4,4.755; B1_A12 3.2,4.755; B4_A9 2.4,4.755 | smd 0.3 x 1.15: A5 -1.25,4.755; A6 -0.25,4.755; A7 0.25,4.755; A8 1.25,4.755; B5 1.75,4.755; B6 0.75,4.755; B7 -0.75,4.755; B8 -1.75,4.755 | drill 0.6 pad 1.05 long: S1 -4.32,4.18; S4 4.32,4.18 | drill 0.6 pad 1 long: S2 -4.32,0; S3 4.32,0 | hole 0.65: 2.89,3.68; -2.89,3.68
3PIN_LOCK_HEADER = drill 1.02: 1 2.54,0; 2 0,0; 3 -2.54,0
10.2MMX7.0MM = smd 2 x 3.1: 1 -4.175,0; 2 4.175,0
CSD17311Q5 = smd 0.75 x 0.675: 1 -2.776,1.918; 2 -2.776,0.66; 3 -2.776,-0.66; 4 -2.776,-1.917 | smd 0.655 x 0.675: 5 2.776,-1.917; 6 2.776,-0.66; 7 2.776,0.66; 8 2.776,1.918 | smd 4.295 x 4.51: 9 0.301,0
SOT23 = smd 0.8 x 0.9: 1 -0.95,-1; 2 0.95,-1; 3 0,1
R0402 = smd 0.7 x 0.9: 1 -0.65,0; 2 0.65,0
QFN50P400X400X80-21N = smd 0.84 x 0.27: 1 -1.935,1; 2 -1.935,0.5; 3 -1.935,0; 4 -1.935,-0.5; 5 -1.935,-1; 11 1.935,-1; 12 1.935,-0.5; 13 1.935,0; 14 1.935,0.5; 15 1.935,1 | smd 0.27 x 0.84: 6 -1,-1.935; 7 -0.5,-1.935; 8 0,-1.935; 9 0.5,-1.935; 10 1,-1.935; 16 1,1.935; 17 0.5,1.935; 18 0,1.935; 19 -0.5,1.935; 20 -1,1.935 | smd 2 x 2: 21 0,0
TPS40305 = smd 0.6 x 0.24: 1 -1.4,1; 2 -1.4,0.5; 3 -1.4,0; 4 -1.4,-0.5; 5 -1.4,-1; 6 1.4,-1; 7 1.4,-0.5; 8 1.4,0; 9 1.4,0.5; 10 1.4,1 | smd 0.25 x 0.5: 11 -0.25,1.45; 12 0.25,1.45; 13 -0.25,-1.45; 14 0.25,-1.45 | smd 1.65 x 2.4: 15 0,0
TSOP-5 = smd 0.7 x 1: 1 -0.95,-1.2; 2 0,-1.2; 3 0.95,-1.2; 4 0.95,1.2; 5 -0.95,1.2
JO32_3.20MMX2.50MM = smd 1.4 x 1.2: 1 -1.1,0.95; 2 -1.1,-0.95; 3 1.1,-0.95; 4 1.1,0.95

### Placement (x,y rotation side)
BOTFIDUCIAL1  11.5,19 0 bottom
BOTFIDUCIAL2  45,50 0 bottom
BOTFIDUCIAL3  15,46.5 0 bottom
C1  10.5,28.5 90 top
C2  5.5,23 180 top
C3  14.5,25.5 0 top
C4  5.5,40 270 top
C5  7.65,49.55 270 top
C6  35.4,16.5 270 top
C7  29,34.92 0 top
C8  29,30.07 0 top
C9  19.85,23.5 90 top
C10  15.5,53.75 90 top
C11  11.5,40 90 top
C12  13.65,49.55 90 top
C13  8,30.2 90 top
C14  29.25,19.6 0 top
C15  33.25,19.6 180 top
C16  29,28.4 0 top
C17  29,36.6 0 top
C18  30.7,23.8 180 top
C19  30.7,25.9 0 top
C20  32.5,28.4 0 top
C21  34.3,26.3 0 top
C22  34.3,38.7 0 top
C23  32.5,36.6 0 top
C24  30.7,39.1 0 top
C25  30.7,41.2 180 top
C26  22.5,38.3 180 top
C27  21.2,36.2 180 top
C28  21.2,28.8 180 top
C29  22.5,26.7 180 top
C30  20,11.5 180 top
C31  20,14.5 180 top
C32  18.5,52.55 270 top
C33  45.65,16 90 top
C34  49.47,16 90 top
C35  53.29,16 90 top
C36  45.65,22.6 270 top
C37  49.47,22.6 270 top
C38  53.29,22.6 270 top
C39  30.2,13.4 0 top
C40  28.1,14 270 top
C41  26,14.9 180 top
C42  26.6,20.1 90 top
C43  29,32.5 180 top
D1  32,58.5 270 top
D2  26.5,58.5 270 top
FB1  4.5,29 0 top
IC1  27.5,32.5 90 bottom
J1  27.5,2.6 0 top
J2  13,2.6 0 top
J3  42,2.6 0 top
J4  16.5,56.5 180 bottom
L1  45,29.75 0 top
Q1  40.05,13.5 0 top
Q2  39.75,19.75 180 top
Q3  28,52 0 top
R1  20.5,6.5 270 top
R2  34.5,6.5 90 top
R3  15.5,17.5 0 top
R4  22.5,55.5 90 top
R5  21,44 90 top
R6  26.9,17 270 top
R7  20,17.5 0 top
R8  15.5,11.5 180 top
R9  15.5,14.5 180 top
R10  24.5,20.7 180 top
R11  26,12.4 0 top
R12  34.21,16.5 90 top
R14  26,13.65 180 top
R15  24.5,19.4 180 top
R16  8,34 270 top
R17  28.1,17 90 top
R18  25.5,55.5 270 top
R19  31,55.5 270 top
TOPFIDUCIAL1  11.5,19 0 top
TOPFIDUCIAL2  45,50 0 top
TOPFIDUCIAL3  15,46.5 0 top
TP1  32,52 0 top
TP2  14.5,27.5 90 top
TP3  9.5,58.5 0 top
TP4  53.25,10.5 0 top
TP5  14.55,39.15 180 top
TP6  12.65,46.5 90 top
TP7  39,39 0 top
TP8  24,52 0 top
TP9  25.5,26 180 top
TP10  32,44 0 top
TP11  34,48 0 top
TP12  28,44 0 top
TP13  26,48 0 top
TP14  30,48 0 top
TP15  22,48 0 top
TP16  24,44 0 top
U1  10,24 90 top
U2  31.3,16.5 0 top
VR1  8.5,40 180 top
VR2  10.65,49.55 180 top
Y1  22.85,23.5 0 top

### Tracks (layer width: path | path; a pad name or v marks a point on that pad's centre or on a via)
!RST  (via drill 0.15)
  Top 0.15: U1.7 v12.64,23.5
  bInner 0.15: v12.64,23.5 12.64,24.5 arc-90 13.64,25.5 v27.26,25.5
  Bottom 0.152: IC1.9 v27.26,25.5
+0V8  (via drill 0.3, 0.5)
  Top 0.25: C26.1 23.38,38.3
  Top 0.27: C29.1 23.38,26.7 | v24.86,27.7 v24.38,27.7
  Top 0.45: 23.38,26.7 v24.38,27.7 | 23.38,38.3 v24.38,37.3
  Top 0.5: TP6.TP 11.6,46.5 v11.6,46.45
  Top 0.7: C12.1 11.6,48.7 VR2.5 v11.6,47.3 v11.6,46.45
  bInner 0.25: v11.6,47.3 11.6,46.87
  bInner 0.6: v24.38,27.7 v24.86,27.7
  bInner 0.7: 11.6,46.87 11.6,42.4 | 11.6,42.4 11.6,38.93 arc45 12.19,37.51 21.41,28.29 arc45 22.83,27.7 v24.38,27.7 | v24.38,37.3 24.38,40.4 arc90 22.38,42.4 11.6,42.4
  bInner 0.75: v11.6,47.3 11.6,46.87 v11.6,46.45
  Bottom 0.27: IC1.18 v24.38,37.3 | IC1.15 v24.38,27.7 v24.86,27.7 IC1.14
+1V5  (via drill 0.3, 0.5)
  Top 0.4: v23.05,20.7 R10.2 R15.2 v23.05,19.4
  bInner 0.45: v23.05,19.4 v23.05,20.7 23.66,21.31 arc-45 25.08,21.9 32.07,21.9 arc45 33.49,22.49 v34.45,23.45 v35,23.45
  other vias: 32,31 31,31 30,31 31.5,30 31,34 30,34 31.5,35 32.5,30 32,32 32,33 32,34 32.5,35 33,34 33,33 33,32 33,31 30.5,35 30.5,30 44.95,25.45 47,30.5 47,29 51,30.5 47.95,25.45 53.95,25.45 50.95,25.45 51,29 47.95,34.95 50.95,34.95 53.95,34.95 44.95,34.95
  pour Top (isolate 0.15, no thermals): 42,23 42,23.38 arc-45 42.29,24.09 43.31,25.11 arc45 43.65,25.92 43.65,31.5 arc90 42.5,32.65 39.5,32.65 arc90 38.35,31.5 38.35,25.98 arc-45 38.06,25.27 36.23,23.44 arc-45 35.52,23.15 34.6,23.15 arc-90 34.15,23.6 34.15,28.8 arc90 33.9,29.05 31.2,29.05 arc90 30.95,28.8 30.95,28.4 arc-90 30.45,27.9 29,27.9 29,37.1 30.45,37.1 arc-90 30.95,36.6 30.95,36.2 arc90 31.2,35.95 33.9,35.95 arc90 34.15,36.2 34.15,39 arc-90 35.15,40 55,40 55,23
  pour Bottom (isolate 0.15, no thermals): 55,25.07 44.83,25.07 arc-45 43.41,25.66 40.31,28.76 arc45 39.14,29.25 29.73,29.25 arc-90 29.57,29.4 29.57,35.6 arc-90 29.73,35.75 55,35.75
  pour bInner (isolate 0.15, no thermals): 55,25.07 44.83,25.07 arc-45 43.41,25.66 40.31,28.76 arc45 39.14,29.25 30.57,29.25 arc-90 29.57,30.25 29.57,34.75 arc-90 30.57,35.75 55,35.75
+1V8  (via drill 0.15, 0.3, 0.5)
  Top 0.15: R5.1 v21,41.6 | 7.8,23 U1.20 8.35,23 | 11,26.15 U1.11 11,25.65
  Top 0.25: 22.05,36.48 C27.1 22.05,35.92 | 22.05,28.52 C28.1 22.05,29.07 | v22.85,24.1 22.85,24.45 Y1.4
  Top 0.27: C2.1 U1.20 | v7.8,22.45 7.8,23 | v8.35,22.45 8.35,23 | v11.6,26.15 11,26.15 | v11.6,25.6 11.6,25.65 11,25.65
  Top 0.45: v23,36.48 22.05,36.48 | v23,28.52 22.05,28.52 | 22.05,35.92 v23,35.92 | 22.05,29.07 v23,29.07
  Top 0.5: C9.2 21.75,24.15 Y1.1 | v11.6,25.6 v11.6,28.5 | 9.45,37.65 v9.05,37.65
  Top 0.7: TP5.TP v12.7,39.15 | v12.7,39.15 C11.1 9.45,39.15 VR1.5 9.45,37.65 | v13.55,39.15 v12.7,39.15 | v22.85,24.8 v22.85,24.1 | Y1.4 Y1.1
  Top 0.75: v11.6,28.5 v12.45,28.5 | v9.95,37.65 v9.05,37.65
  bInner 0.15: v21,41.6 21,39.15 | v23,36.48 23,36.5
  bInner 0.5: v23,28.52 26.79,28.52 arc-90 28.4,26.91 28.4,26.06 arc-90 26.79,24.45 22.85,24.45 | v11.6,26.15 11.6,23.45 arc-90 10.6,22.45 v7.8,22.45
  bInner 0.7: v23,28.52 23,36.5 23,37.15 arc90 21,39.15 v12.7,39.15 | v22.85,24.8 22.85,24.45 v22.85,24.1
  bInner 0.75: v12.45,28.5 12.03,28.5 | 12.03,28.5 v11.6,28.5 | v9.95,37.65 9.5,37.65 | 9.5,37.65 v9.05,37.65 | 9.5,37.65 9.5,35.33 arc45 10.09,33.91 11.44,32.56 arc-45 12.03,31.15 12.03,28.5
  Bottom 0.27: IC1.17 23.9,36.48 v23,36.48 | IC1.16 23.9,28.52 v23,28.52
+5V  (via drill 0.3, 0.5)  (2 unrouted)
  Top 0.152: D2.A 27.55,58.8
  Top 0.25: D1.A 33.05,58.8 | 28.7,19.6 C14.1 28.3,19.62 28.32,19.65 | U2.1 29.9,18
  Top 0.3: 29.9,17.55 29.9,18.05
  Top 0.35: 29.9,17.55 29.9,18
  Top 0.4: C14.1 29.9,18 29.9,17.6 | 16.5,57.5 16.5,55.5 | 15.5,56.5 17.5,56.5
  Top 0.5: 28.32,21 28.5,21
  Top 0.7: VR1.1 9.45,42.1 arc90 9.2,42.35 7.8,42.35 arc90 7.55,42.1 VR1.3 arc-45 6.22,40.65 C4.1 4.35,40.65 | C5.1 8.37,50.2 arc45 VR2.3 9.7,51.65 arc-90 9.95,51.9 11.35,51.9 arc-90 11.6,51.65 VR2.1
  Top 0.75: v27.9,21 28.32,21 28.32,19.65 | 28.5,21 v28.75,21
  Top 2: 8.6,52.35 8.6,50.95
  bInner 0.75: v45.7,12.7 45.7,14.77 arc45 45.11,16.18 43.68,17.61 arc-45 43.1,19.03 43.1,20.07 arc-45 43.51,21.07 arc45 44.1,22.48 arc90 43.1,23.48 40.99,23.48 arc45 39.57,22.89 38.27,21.59 arc-45 36.85,21 v27.9,21
  other vias: 47.7,12.7 49.7,12.7 51.7,12.7 53.7,12.7 40,6.25 40.5,6.25 43.5,6.25 44,6.25 41,6.25 43,6.25 11,6.25 11.5,6.25 12,6.25 15,6.25 14.5,6.25 14,6.25 46.7,10.2 48.7,10.2 44.7,10.2
  pour Top (isolate 0.15, rank 4, no thermals): 0,4 0,56 arc-90 4,60 51,60 arc-90 55,56 55,4 arc-90 51,0 4,0 arc-90
  pour bInner (isolate 0.15, no thermals): 10.5,0 10.5,6 arc-90 11.5,7 37.17,7 arc45 38.59,7.59 43.91,12.91 arc-45 45.33,13.5 55,13.5 55,4 arc-90 51,0
BI  (via drill 0.15)
  Top 0.15: U1.16 8,25 v8,25.44
  bInner 0.15: v27.74,26 22.26,26 arc-45 21.56,26.29 21.09,26.76 arc45 20.39,27.05 9,27.05 arc90 8,26.05 v8,25.44
  Bottom 0.152: IC1.8 v27.74,26
BP  (via drill 0.15)
  Top 0.25: U2.10 v32.7,18.25 | R6.1 v27.5,18.25 R17.2
  Top 0.4: 33.85,18.25 arc90 34.2,18.6 C15.1 | v32.7,18.25 33.75,18.25 | 33.75,18.25 33.85,18.25 | 33.85,18.25 33.85,19.6 | 33.75,18.25 33.75,19.6 | R6.1 26.9,17.75
  bInner 0.15: v32.7,18.25 v27.5,18.25
CC1  (via drill 0.15)
  Top 0.15: J1.A5 v26.25,6.48 | R1.2 v20.5,4.85
  bInner 0.15: v26.25,6.48 26.25,5.85 arc-90 25.25,4.85 v20.5,4.85
CC2  (via drill 0.15)
  Top 0.15: R2.1 v34.5,4.85 | v29.25,6.48 J1.B5
  bInner 0.15: v34.5,4.85 30.25,4.85 arc-90 29.25,5.85 v29.25,6.48
CLK  (via drill 0.3)
  Top 0.152: 23.95,22.5 Y1.3
  Top 0.27: v25.5,27.5 TP9.TP 25.5,24.41 arc-45 25.21,23.71 24.05,22.55 Y1.3
  Bottom 0.27: IC1.12 25.82,27.82 v25.5,27.5
FB+5V
  Top 0.25: C13.1 8,29 8.3,29
  Top 0.27: U1.12 C1.1
  Top 0.5: FB1.2 8,29 | C1.1 9.71,27.85 arc-45 9.26,28.04 8.3,29
GND  (via drill 0.15, 0.2, 0.3, 0.5, 3.1 pad 7.5, 3.6 pad 7.5)  (1 unrouted)
  Top 0.25: Q3.2 v28.95,50.15 | 10,24.5 v9.5,24.5 | 21.45,22.85 Y1.2 | 21.7,26.7 C29.2
  Top 0.3: v21.35,11.5 C30.1
  tInner 0.4: 19.04,57.5 19.04,55.5 | 18.04,56.5 20.04,56.5
  bInner 0.4: 19.04,57.5 19.04,55.5 | 18.04,56.5 20.04,56.5
  Bottom 0.4: 19.04,57.5 19.04,55.5 | 18.04,56.5 20.04,56.5
  other vias: 50.99,4.01 4.01,4.01 4.01,55.99 24,35 24,34 24,33 24,32 24,31 24,30 25,30 25,31 25,32 25,33 25,34 25,35 26,35 27,35 27,34 26,34 26,33 26,32 26,31 26,30 27,30 27,31 28,31 28,34 42,55.99 50.99,47 10.5,24.5 9.5,23.5 10.5,23.5 10,24 12.45,40.52 12.45,41.17 8.5,40.28 8.5,39.72 5.5,38.63 5.5,38.08 7.65,48.18 7.65,47.63 10.65,49.88 10.65,49.33 14.6,50.08 14.6,50.73 10.5,29.9 10.5,30.45 14.15,17.5 21.35,14.5 15.15,24.65 15.15,24.1 19.4,28.8 18.85,28.8 20.55,26.55 20,26.55 19.4,36.2 18.85,36.2 20.15,38.3 20.7,38.3 20.68,22.9 20.68,22.3 32.5,23.8 33.05,23.8 32.5,41.2 33.05,41.2 31.3,17.5 31.8,16.5 31.3,15.5 30.8,16.5 45.2,18.8 46.7,18.8 48.2,18.8 49.7,18.8 51.2,18.8 52.7,18.8 54.2,18.8 44.45,19.8 45.95,19.8 47.45,19.8 48.95,19.8 50.45,19.8 51.95,19.8 53.45,19.8 34.21,15.1 31.3,19 31.3,19.6 31.3,20.2 24.5,12.4 8,35.4 8,35.95 15.2,52.3 15.8,52.3 17.4,52.35 18.15,52.35 18.85,52.35 19.6,52.35 47.56,22.45 51.38,22.45 51.38,17 47.56,17 30.8,14.5 31.8,14.5 30.8,12.5 31.8,12.5 5,24 5,22 8.47,25.85 10,21.28 29,27.5 53.88,7.5 53.45,8.95 51.88,8.5 46.33,4.65 8.68,4.7 1,7.5 1.9,8.95 3.5,8.5 37.5,59 37,56.5 37,54 38.5,52 54,42.5 51.5,42 49,42 47,43.5 41.5,51 46,46.5
  pour Bottom (isolate 0.15, rank 2, no thermals): 0,4 0,56 arc-90 4,60 51,60 arc-90 55,56 55,4 arc-90 51,0 4,0 arc-90
  pour Top (isolate 0.15, rank 2, no thermals): 55,4 55,11.14 53.36,11.14 arc45 52.65,10.85 49.79,7.99 arc-45 49.09,7.7 47.5,7.7 arc150 44.9,7.9 44.9,5.85 39.1,5.85 39.1,7.9 arc150 36.5,7.7 18.5,7.7 arc150 15.9,7.9 15.9,5.85 10.1,5.85 10.1,7.9 arc150 7.5,7.7 5.71,7.7 arc-45 5.01,7.99 2.29,10.71 arc45 1.59,11 0,11 0,4 arc90 4,0 51,0 arc90
  pour Top (isolate 0.15, rank 2, no thermals): 51,60 33.7,60 33.7,56.5 arc-90 31.7,54.5 13.3,54.5 arc43 12.63,54.24 4.82,47.06 arc47 4.5,46.32 4.5,21.68 arc90 5.5,20.68 7.66,20.68 arc-45 9.07,20.1 12.67,16.5 arc-45 13.26,15.08 13.26,15.05 arc90 14.26,14.05 21.74,14.05 arc-45 22.44,13.76 23.96,12.24 arc45 24.66,11.95 34.39,11.95 arc45 35.09,12.24 35.56,12.71 arc45 35.85,13.41 35.85,16.57 55,16.57 55,56 arc90
  pour tInner (isolate 0.15, rank 2, no thermals): 0,4 0,56 arc-90 4,60 51,60 arc-90 55,56 55,4 arc-90 51,0 4,0 arc-90
  pour bInner (isolate 0.15, rank 3, no thermals): 0,4 0,56 arc-90 4,60 51,60 arc-90 55,56 55,4 arc-90 51,0 4,0 arc-90
HDRV  (via drill 0.3)
  Top 0.25: U2.7 v33.4,16
  Top 0.4: v33.4,15.5 v33.4,16
  Top 0.45: v36.5,11.35 v36.5,11.9 Q1.4 v36.5,11.35
  bInner 0.75: v36.5,11.35 v36.5,11.9 36.5,13.5 arc90 35.75,14.25 34.15,14.25 arc-90 33.4,15 v33.4,15.5 v33.4,16
LDRV  (via drill 0.3)
  Top 0.25: U2.9 v33.4,17 | 34.21,17 R12.2
  Top 0.4: v33.4,17.5 v33.4,17 34.21,17
  Top 0.5: v42.85,22.45 v42.2,22.45 Q2.4 v42.85,22.45
  bInner 0.75: v42.85,22.45 v42.2,22.45 41.83,22.45 arc45 39.81,21.61 36.09,17.89 arc-45 34.67,17.3 33.4,17.3 | v33.4,17.5 33.4,17.3 | 33.4,17.3 v33.4,17
LIN
  pour Top (isolate 0.15, no thermals): 38.05,15.57 38.05,13.07 arc-90 37.45,12.47 37,12.47 arc-90 36,13.47 36,22.59 arc-45 36.29,23.29 38.16,25.16 arc45 38.5,25.98 38.5,31.5 arc-90 39.5,32.5 42.5,32.5 arc-90 43.5,31.5 43.5,25.91 arc-45 43.21,25.21 42.19,24.19 arc45 41.85,23.37 41.85,17.57 arc-90 40.85,16.57 39.05,16.57 arc90
N$1
  Top 0.5: R16.2 C13.2
N$2  (via drill 0.15)
  Top 0.15: U1.8 v13.03,24 | v14.13,11.5 R8.2
  bInner 0.15: v13.03,24 13.15,24 arc-45 13.86,23.71 16.39,21.18 arc-45 16.68,20.48 16.68,18.04 arc-45 16.39,17.33 14.72,15.67 arc45 14.13,14.23 v14.13,11.5
N$3  (via drill 0.15)
  Top 0.15: J1.A6 v27.25,8.24 27.93,8.24 arc-90 28.25,7.91 J1.B6 | R8.1 v18.5,11.5 C30.2
  bInner 0.15: v27.25,8.24 19.9,8.24 arc-90 18.5,9.64 v18.5,11.5
N$4  (via drill 0.15)
  Top 0.15: J1.A7 27.75,6.8 arc-90 27.43,6.48 v26.75,6.48 J1.B7 | R9.1 v18,14.5 C31.2
  bInner 0.15: v26.75,6.48 25.62,7.61 arc45 24.99,7.87 19.88,7.87 arc-90 18,9.75 v18,14.5
N$5
  Top 0.152: 30.95,56.15 R19.1
  Top 0.25: D1.C 30.95,56.15
N$6  (via drill 0.15)
  Top 0.15: v14.85,15.25 R9.2 | U1.9 v13.5,24.5
  bInner 0.15: v13.5,24.5 16.71,21.29 arc-45 17,20.59 17,17.81 arc-45 16.71,17.1 v14.85,15.25
N$7  (1 unrouted)
N$8  (via drill 0.15)
  Top 0.15: R7.1 R3.2 v16.15,18.5 | U1.15 v9,26.64
  bInner 0.15: v9,26.64 11.68,26.64 arc-90 12.18,26.14 12.18,20.24 arc45 12.47,19.53 13.21,18.79 arc45 13.91,18.5 v16.15,18.5
N$9  (via drill 0.15)
  Top 0.15: J1.B4_A9 v29.9,8.6 | J1.A4_B9 v25.1,8.6 | R7.2 v20.65,16.75
  bInner 0.15: v29.9,8.6 v25.1,8.6 20,8.6 arc-90 19,9.6 19,15.75 arc-90 20,16.75 v20.65,16.75
N$10
  Top 0.25: U2.4 29.15,16 arc90 28.9,15.75 28.9,15.5 arc-45 28.83,15.33 28.15,14.65 C40.1 | C41.1 26.65,14.65
  Top 0.4: 26.65,14.65 C40.1
N$11
  Top 0.15: TP2.TP 14.5,27.06 arc-45 C3.1
  Top 0.25: U1.10 13.35,25 C3.1
N$12  (via drill 0.3)
  Top 0.152: TP1.TP v31,53
  Top 0.25: R19.2 v31,53 | v8.17,28.15 9.24,27.08 arc-45 9.5,26.46 U1.14
  bInner 0.25: v8.17,28.15 2,28.15 arc-90 1,29.15 1,56 arc-90 4,59 20,59 arc-90 21,58 21,54 arc90 22,53 v31,53
N$13
  Top 0.4: R14.2 C41.2
N$14  (via drill 0.3)
  Top 0.25: C19.2 31.06,26.39 arc-45 v30.84,27.4 arc-45 30.98,27.73 C20.1
  Bottom 0.25: IC1.2 30.62,27.7 arc45 v30.84,27.4
N$15  (1 unrouted)
N$16
  Top 0.25: U2.6 32.7,15.1 arc90 33.2,14.6 34.9,14.6 arc90 35.4,15.1 C6.2
N$17  (via drill 0.3)
  Top 0.27: v30.14,26.95 30.14,25.9 C19.1 C18.2
  Bottom 0.27: IC1.3 v30.14,26.95
N$18  (via drill 0.3)
  Top 0.25: 33.45,28.3 C20.2 32.61,27.66 arc45 v32.5,27.4 arc45 32.61,27.14 C21.1
  Bottom 0.25: IC1.1 31.7,28.57 arc-90 32.5,27.77 v32.5,27.4
N$19  (via drill 0.3)
  Top 0.25: 33.34,36.6 C23.2 32.61,37.34 arc-45 v32.5,37.6 arc-45 32.61,37.86 C22.1 33.37,38.7
  Bottom 0.25: v32.5,37.6 32.5,37.23 arc-90 31.7,36.44 IC1.32
N$20  (via drill 0.3)
  Top 0.25: C24.2 31.95,38.7 31.5,38.7 30.99,38.19 arc45 v30.75,37.6 arc45 30.81,37.44 C23.1
  Bottom 0.25: IC1.31 30.62,37.3 arc-45 v30.75,37.6
N$21  (via drill 0.3)
  Top 0.15: C24.1 30.14,39.1 30.14,38.7
  Top 0.3: C25.2 C24.1 | 30.14,38.7 v30.14,38.05
  Bottom 0.27: v30.14,38.05 IC1.30
N$25  (via drill 0.15)
  Top 0.152: v25.82,42.18 TP16.TP
  Bottom 0.152: IC1.21 v25.82,42.18
N$26  (via drill 0.15)
  Top 0.152: v26.3,43.7 TP15.TP
  Bottom 0.152: IC1.22 v26.3,43.7
N$27  (via drill 0.15)
  Top 0.152: v27.74,46.26 TP13.TP
  Bottom 0.152: IC1.25 v27.74,46.26
N$28  (via drill 0.15)
  Top 0.152: v28.22,43 arc-45 28,43.53 TP12.TP
  Bottom 0.152: IC1.26 v28.22,43
N$30  (via drill 0.15)
  Top 0.15: v21,45.45 R5.2
  Top 0.152: v28.7,46.7 TP14.TP
  bInner 0.15: v28.7,46.7 27.74,45.74 arc-45 27.04,45.45 v21,45.45
  Bottom 0.152: IC1.27 v28.7,46.7
N$32  (via drill 0.15)
  Top 0.152: v29.18,43.18 TP11.TP
  Bottom 0.152: IC1.28 v29.18,43.18
N$33  (via drill 0.15)
  Top 0.15: TP10.TP 30.34,42.34 arc-45 v29.66,42.06
  Bottom 0.152: IC1.29 v29.66,42.06
N$37
  Top 0.25: 35.15,16.5 arc90 35.4,16.75 C6.1 | U2.8 35.08,16.5 | 35.08,16.5 35.15,16.5 | 35.15,16.5 35.15,17.15 | 35.08,16.5 35.08,17.15
N$55
  Top 0.4: R15.1 26.6,19.4 C42.1
N$56
  Top 0.15: 26.8,13.35 26.65,13.5
  Top 0.25: R10.1 24.75,20.7 arc90 24.5,20.45 | 24.5,20.45 24.5,20.37 | 24.5,20.37 24.5,18.16 arc45 24.79,17.46 25.71,16.54 arc-45 26,15.84 26,13.98 | 26,13.98 26,13.9 | 26,13.9 arc90 26.25,13.65 R14.1 | 25.15,20.45 24.5,20.45 | 25.15,20.37 24.5,20.37 | 26,13.9 26.65,13.9 | 26,13.98 26.65,13.98 | C40.2 29.75,15 arc45 29.9,15.36 U2.5
  Top 0.3: C40.2 26.8,13.35
  Top 0.4: R11.2 26.65,13.5 R14.1 | R10.1 26.6,20.7 C42.2
N$58
  Top 0.25: D2.C 25.5,58.5 R18.1
N$60
  Top 0.25: R18.2 25.94,54.85 arc-45 26.3,54.7 Q3.3
PGOOD  (via drill 0.15)
  Top 0.15: Q3.1 25.41,51 arc-45 24.71,51.29 TP8.TP 22.79,53.21 arc-45 22.5,53.91 R4.1 22.5,55 v21.5,55 | U2.3 v29,16.5 28.25,16.5 R17.1
  bInner 0.15: v29,16.5 28.52,16.98 arc45 27.81,17.28 18.5,17.28 arc90 17.5,16.28 17.5,12.07 arc-90 16.5,11.07 14,11.07 arc-90 13,12.07 13,17.99 arc45 12.71,18.69 10.82,20.58 arc45 10.11,20.88 7.55,20.88 arc-90 6.55,21.88 6.55,26.7 arc90 5.55,27.7 1.5,27.7 arc-90 0.5,28.7 0.5,56 arc-90 4,59.5 20.5,59.5 arc-90 21.5,58.5 v21.5,55
RX  (via drill 0.15)
  Top 0.15: U1.1 v9,21.36
  bInner 0.15: v26.78,27 22.26,27 arc-45 21.56,27.29 21.45,27.4 arc45 20.74,27.7 7.95,27.7 arc90 6.95,26.7 6.95,22.36 arc90 7.95,21.36 v9,21.36
  Bottom 0.152: IC1.10 v26.78,27
SS  (via drill 0.15)
  Top 0.15: v29.3,17 27.15,17 arc90 26.9,16.75 R6.2
  Top 0.25: U2.2 v29.3,17 | 29.55,13.6 C39.1 v29.55,14.15
  bInner 0.25: v29.55,14.15 29.55,16.54 arc45 29.4,16.9 v29.3,17
TX  (via drill 0.15)
  Top 0.15: U1.17 v7.36,24.5
  bInner 0.15: v26.3,26.5 22.26,26.5 arc-45 21.56,26.79 21.27,27.08 arc45 20.56,27.37 8.36,27.37 arc90 7.36,26.37 v7.36,24.5
  Bottom 0.152: IC1.11 v26.3,26.5
(copper drawn outside any net)
  shapes: Bottom circle x3, Top circle x3, bInner circle x2, tInner circle x2

### Text on the board
bPlace: FAN | RX/TX | PGOOD | V1.0 | bm1397 | Quarter Stick | AUX / PWR | PC | POWER